# EAGLE design C1G14 VCO V5 (EAGLE 9.6.2)
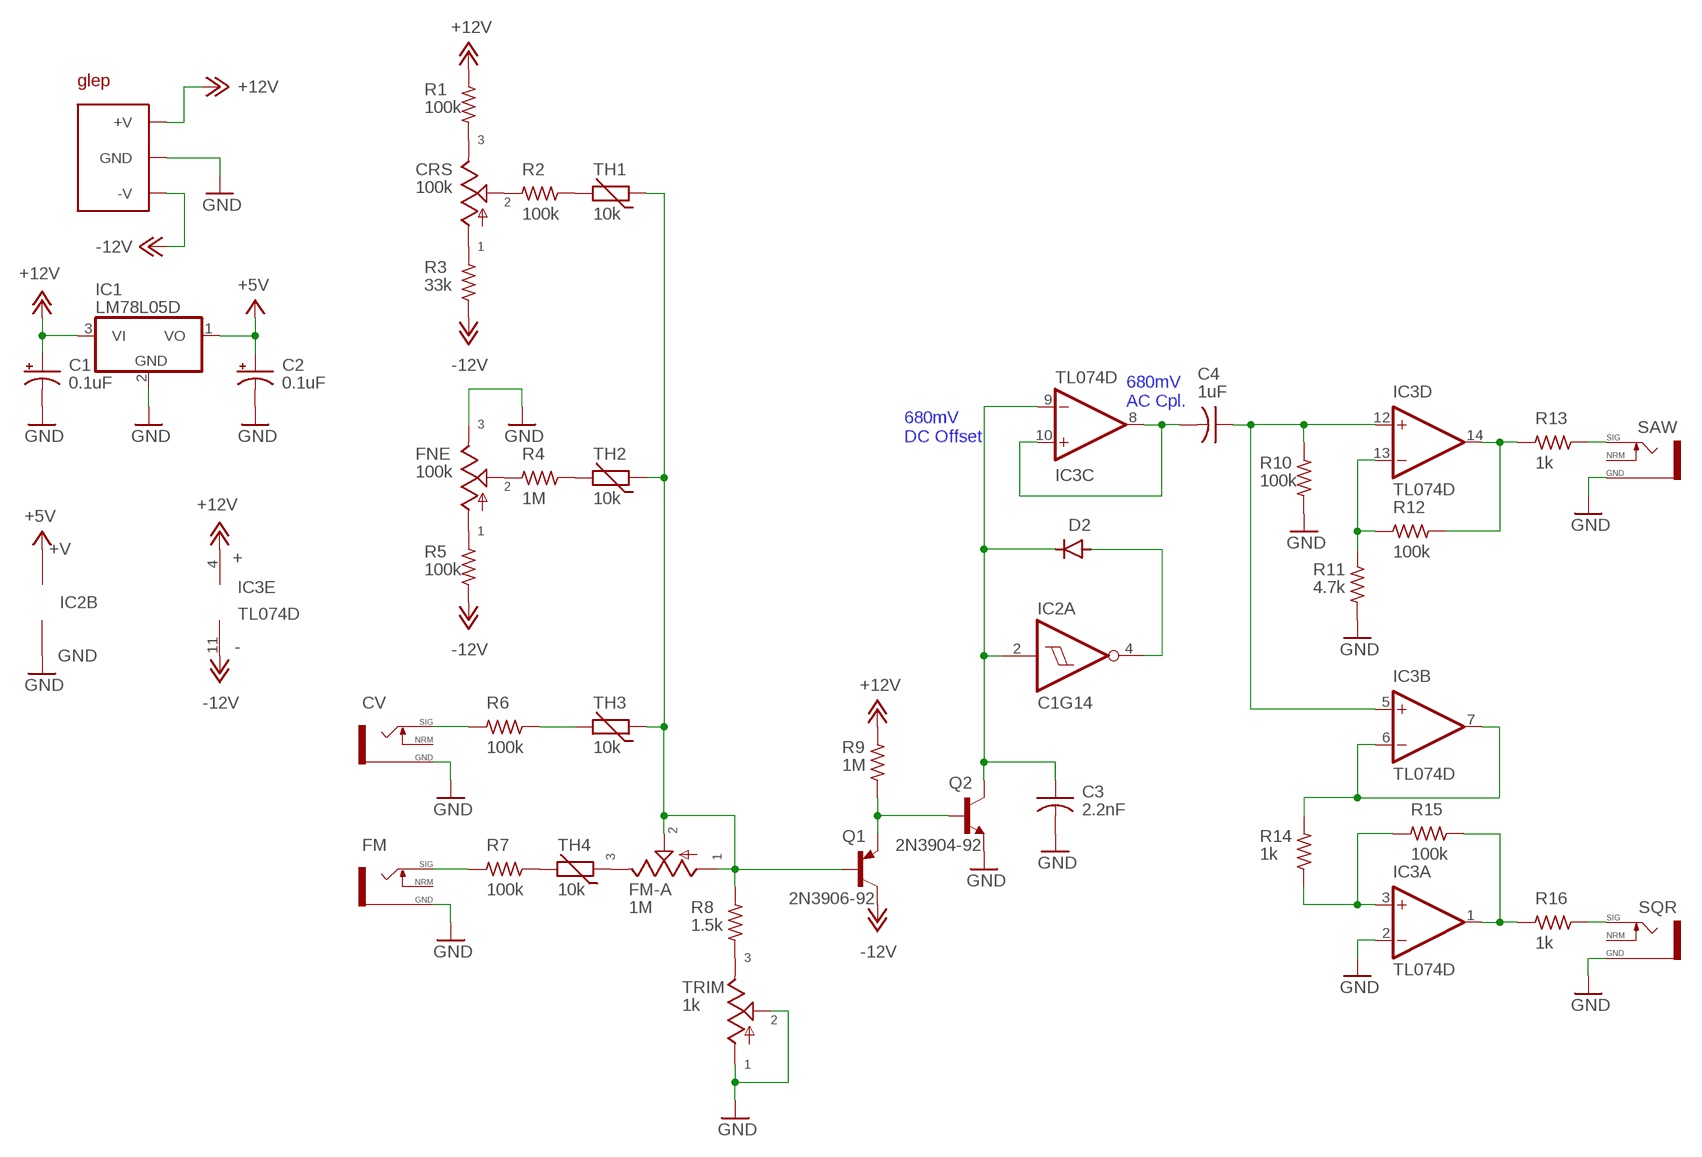
[diagram p0: schematic, sheet 1]

## Parts
C1  0.1uF  CPOL-E025  [E025]
C2  0.1uF  CPOL-E025  [E025]
C3  2.2nF  C-05  [C05]
C4  1uF  C-05  [C05]
CRS  100k  PHDR  [HEADER]
CV  MONOHDR  [HEADER]
D2  D-123  [SOD-123]
FM  MONOHDR  [HEADER]
FM-A  1M  PHDR  [HEADER]
FNE  100k  PHDR  [HEADER]
IC1  LM78L05D  [LM78LXX]
IC2  C1G14  [SOT-23-5]
IC3  TL074D  [DIL14]
Q1  2N3906-92  [TO92]
Q2  2N3904-92  [TO92]
R1  100k  R-1206  [R1206]
R2  100k  R-1206  [R1206]
R3  33k  R-1206  [R1206]
R4  1M  R-1206  [R1206]
R5  100k  R-1206  [R1206]
R6  100k  R-1206  [R1206]
R7  100k  R-1206  [R1206]
R8  1.5k  R-1206  [R1206]
R9  1M  R-1206  [R1206]
R10  100k  R-1206  [R1206]
R11  4.7k  R-1206  [R1206]
R12  100k  R-1206  [R1206]
R13  1k  R-1206  [R1206]
R14  1k  R-1206  [R1206]
R15  100k  R-1206  [R1206]
R16  1k  R-1206  [R1206]
SAW  MONOHDR  [HEADER]
SQR  MONOHDR  [HEADER]
TH1  10k  TH-025  [TH025]
TH2  10k  TH-025  [TH025]
TH3  10k  TH-025  [TH025]
TH4  10k  TH-025  [TH025]
TRIM  1k  PHDR  [HEADER]
U$1  10PIN-PWR  [10PIN-HEADER]
U$2  GLEP  [GLEP]

## Nets
+5V: C2.+ IC1.1(VO) IC2.5(B:V+)
+12V: C1.+ IC1.3(VI) IC3.4(E:V+) R1.2 R9.2 U$1.9(+V) U$1.10(+V)
-12V: IC3.11(E:V-) Q1.3(C) R3.1 R5.1 U$1.1(-V) U$1.2(-V)
GND: C1.- C2.- C3.2 CV.GND(SLEEVE-GND) FM.GND(SLEEVE-GND) FNE.3 IC1.2(GND) IC2.3(B:GND) IC3.2(A:INVERTING(-)) Q2.1(E) R10.1 R11.1 SAW.GND(SLEEVE-GND) SQR.GND(SLEEVE-GND) TRIM.1 TRIM.2 U$1.3(GND) U$1.4(GND) U$1.5(GND) U$1.6(GND) U$1.7(GND) U$1.8(GND)
N$1: CRS.2 R2.1
N$2: C4.2 IC3.8(C:OUT) IC3.10(C:NON-INVERTING(+))
N$3: CRS.1 R3.2
N$4: R2.2 TH1.2
N$5: CRS.3 R1.1
N$6: FNE.2 R4.1
N$7: R4.2 TH2.2
N$8: FNE.1 R5.2
N$9: IC3.6(B:INVERTING(-)) IC3.7(B:OUT) R14.2
N$10: R6.2 TH3.2
N$11: FM.TIP-SIG R7.1
N$12: R7.2 TH4.2
N$13: FM-A.3 TH4.1
N$14: R8.1 TRIM.3
N$15: CV.TIP-SIG R6.1
N$16: Q1.1(E) Q2.2(B) R9.1
N$17: C4.1 IC3.5(B:NON-INVERTING(+)) IC3.12(D:NON-INVERTING(+)) R10.2
N$18: C3.1 D2.C IC2.2(A:A) IC3.9(C:INVERTING(-)) Q2.3(C)
N$19: D2.A IC2.4(A:Y)
N$20: IC3.13(D:INVERTING(-)) R11.2 R12.1
N$21: IC3.14(D:OUT) R12.2 R13.1
N$22: R13.2 SAW.TIP-SIG
N$23: FM-A.1 FM-A.2 Q1.2(B) R8.2 TH1.1 TH2.1 TH3.1
N$24: IC3.3(A:NON-INVERTING(+)) R14.1 R15.1
N$25: IC3.1(A:OUT) R15.2 R16.1
N$26: R16.2 SQR.TIP-SIG
Unconnected: CV.NORM(SWITCH-NORM) FM.NORM(SWITCH-NORM) SAW.NORM(SWITCH-NORM) SQR.NORM(SWITCH-NORM)

## Notes on the sheet
- 680mV
  AC Cpl.
- 680mV
  DC Offset

## Library data of the parts
C1 C2 = wb-rcl:CPOL
C3 C4 = wb-rcl:C
CRS FM-A FNE TRIM = wb-potswitch:P
CV FM SAW SQR = wb-jacks:MONO
D2 = wb-diode:D
IC1 = wb-power:LM78L05
IC2 = wb-logic:C1G14
IC3 = wb-opamps:TL074: Low-Noise FET-Input Operational Amplifier https://www.ti.com/lit/ds/symlink/tl074.pdf
Q1 = wb-transistors:2N3906: https://www.mouser.com/datasheet/2/149/2n3906-285843.pdf
Q2 = wb-transistors:2N3904: https://www.mouser.com/datasheet/2/149/2N3904-82270.pdf
R1-R16 = wb-rcl:R
TH1-TH4 = wb-rcl:TH
U$1 = wb-power:10PIN-PWR
U$2 = wb-art:GLEP

## Board
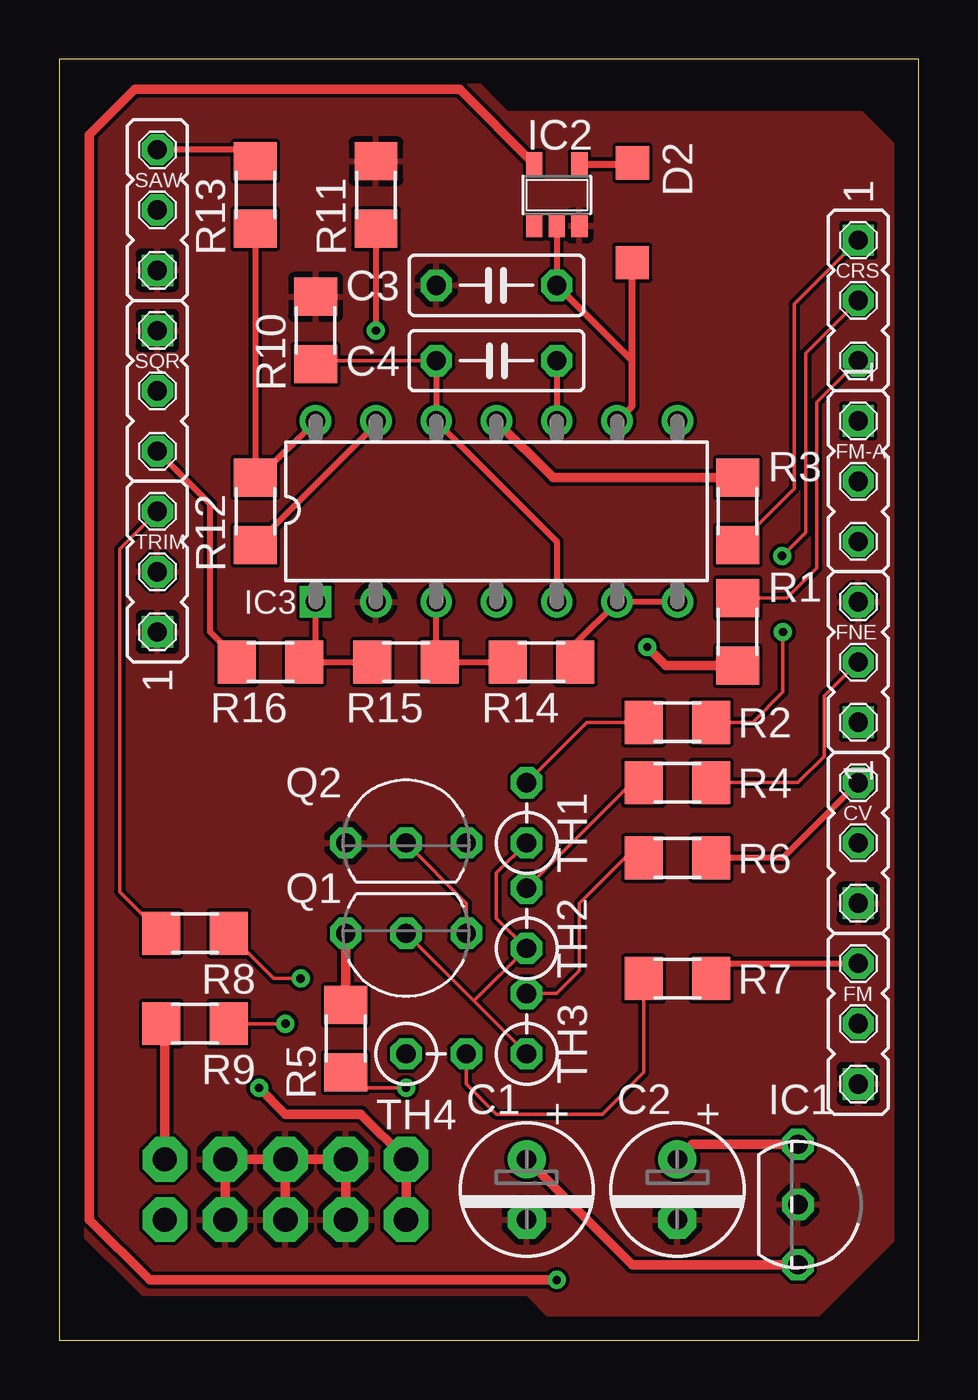
[diagram p1: board, top side]
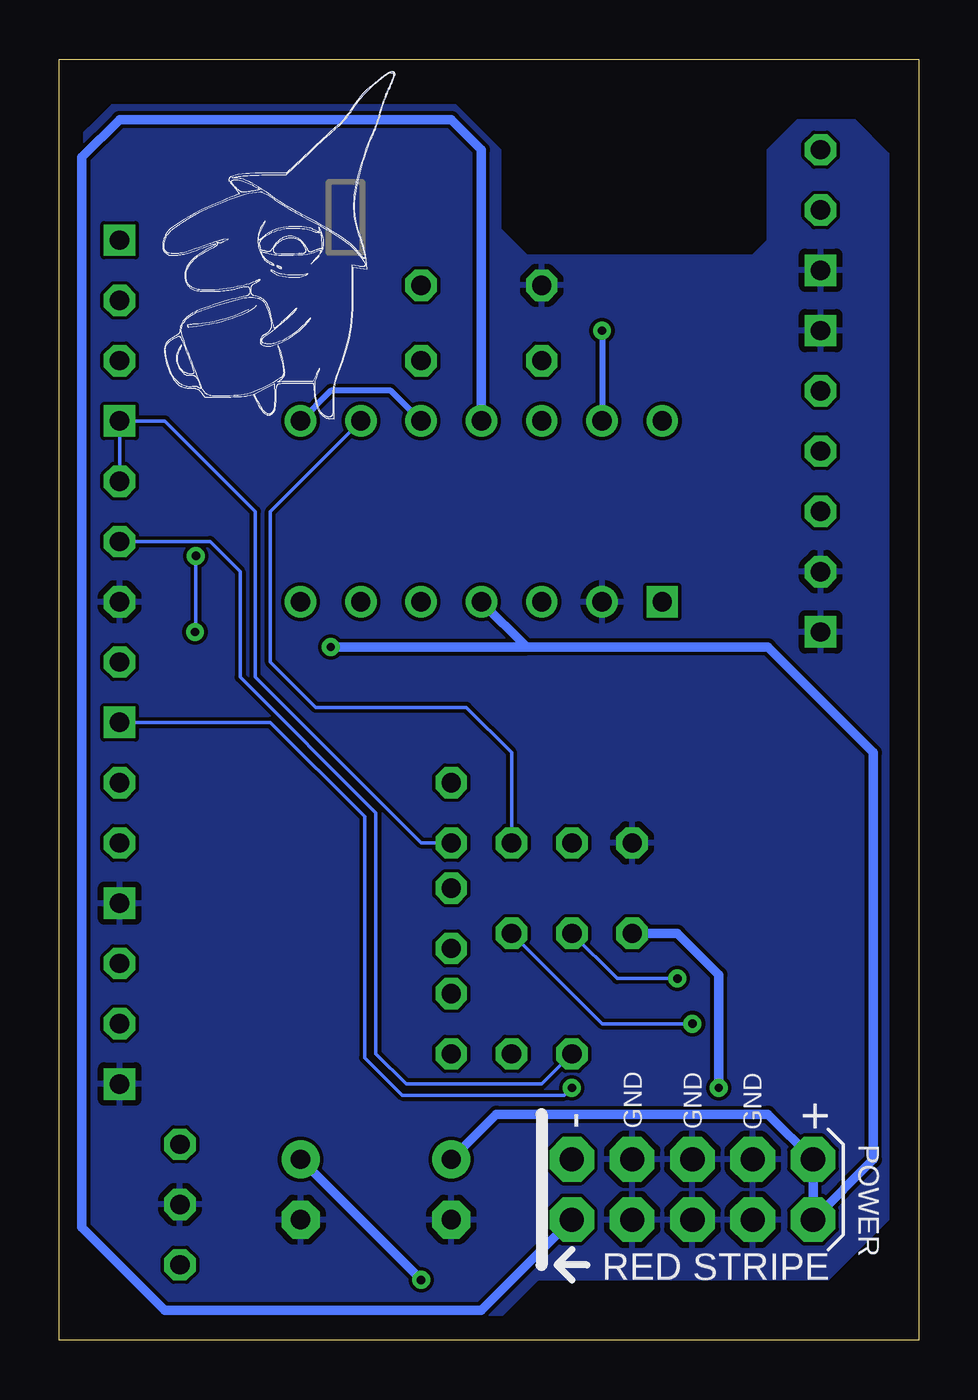
[diagram p2: board, bottom side, seen from below]

Size 36.2 x 53.98 mm. Coordinates in mm from the lower left corner, seen from the top.
Outline: 0,0 36.2,0 36.2,53.98 0,53.98 0,0
Copper layers (1*16): Top 0.035mm / dielectric 1.5mm / Bottom 0.035mm
Design rules "default": minimum track width 6mil, minimum drill 0.35mm, track to track 6mil, track to pad 6mil, pad to pad 6mil, via to via 6mil, smd to smd 6mil, copper to edge 40mil, drill to drill 6mil, minimum pad ring 10mil, minimum via ring 8mil, stop-mask expansion 4mil, vias tented up to drill 0mil, thermal gap 10mil

### Footprints (pad centres in the part's own frame; a part is rotated, then mirrored left to right if it is on the bottom)
E025 = drill 0.813 pad 1.6: + -1.27,0 | drill 0.813 pad 1.6 octagon: - 1.27,0
C05 = drill 0.813 octagon: 1 -2.54,0; 2 2.54,0
HEADER = drill 0.813 square: 1 -2.54,0 | drill 0.813 octagon: 2 0,0; 3 2.54,0
HEADER' = drill 0.813 square: GND -2.54,0 | drill 0.813 octagon: NORM 0,0; TIP-SIG 2.54,0
SOD-123 = smd 1.4 x 1.4: A -1.984,0.013; C 2.223,0
LM78LXX = drill 0.813 octagon: 1 -2.54,0; 2 0,0; 3 2.54,0
SOT-23-5 = smd 0.69 x 0.99: 1 -0.95,-1.29; 2 0,-1.29; 3 0.95,-1.29; 4 0.95,1.3; 5 -0.95,1.3
DIL14 = drill 0.813 square: 1 -7.62,-3.81 | drill 0.813: 2 -5.08,-3.81; 3 -2.54,-3.81; 4 0,-3.81; 5 2.54,-3.81; 6 5.08,-3.81; 7 7.62,-3.81; 8 7.62,3.81; 9 5.08,3.81; 10 2.54,3.81; 11 0,3.81; 12 -2.54,3.81; 13 -5.08,3.81; 14 -7.62,3.81
TO92 = drill 0.813 octagon: 1 -2.54,0; 2 0,0; 3 2.54,0
R1206 = smd 1.6 x 1.803: 1 -1.422,0; 2 1.422,0
TH025 = drill 0.813 octagon: 1 -1.27,0; 2 1.27,0
10PIN-HEADER = drill 1.016 pad 1.88 octagon: 1 -5.08,-1.27; 2 -5.08,1.27; 3 -2.54,-1.27; 4 -2.54,1.27; 5 0,-1.27; 6 0,1.27; 7 2.54,-1.27; 8 2.54,1.27; 9 5.08,-1.27; 10 5.08,1.27

### Placement (x,y rotation side)
C1  19.68,6.35 270 top
C2  26.04,6.35 270 top
C3  18.41,44.45 180 top
C4  18.41,41.27 0 top
CRS  33.66,43.81 270 top
CV  [HEADER']  33.66,20.95 90 top
D2  24.13,47.62 270 top
FM  [HEADER']  33.66,13.34 90 top
FM-A  33.66,36.2 270 top
FNE  33.66,28.57 90 top
IC1  31.11,5.71 270 top
IC2  20.95,48.26 0 top
IC3  18.41,34.92 0 top
Q1  14.61,17.14 180 top
Q2  14.61,20.95 0 top
R1  28.57,29.84 270 top
R2  26.04,26.04 180 top
R3  28.57,34.92 270 top
R4  26.04,23.5 180 top
R5  12.06,12.7 270 top
R6  26.04,20.32 180 top
R7  26.04,15.24 180 top
R8  5.71,17.14 0 top
R9  5.71,13.34 180 top
R10  10.79,42.55 270 top
R11  13.34,48.26 270 top
R12  8.26,34.92 90 top
R13  8.26,48.26 90 top
R14  20.32,28.57 0 top
R15  14.61,28.57 180 top
R16  8.89,28.57 180 top
SAW  [HEADER']  4.13,47.62 90 top
SQR  [HEADER']  4.13,40.01 270 top
TH1  19.68,22.23 90 top
TH2  19.68,17.78 90 top
TH3  19.68,13.34 90 top
TH4  15.88,12.06 0 top
TRIM  4.13,32.38 90 top
U$1  9.53,6.35 0 bottom
U$2  26.35,43.81 0 bottom

### Tracks (layer width: path | path; a pad name or v marks a point on that pad's centre or on a via)
+5V  (via drill 0.35)
  Top 0.406: IC1.1 26.67,8.26 C2.+ | IC2.5 16.86,52.7 3.17,52.7 1.27,50.8 1.27,5.08 3.81,2.54 v20.95,2.54
  Bottom 0.406: C2.+ v20.95,2.54
+12V  (via drill 0.35)
  Top 0.406: R9.2 4.45,13.18 U$1.10 | C1.+ 24.13,3.17 IC1.3 | 28.57,27.94 R1.2 25.55,28.42 v24.77,29.21
  Bottom 0.406: 16.51,29.21 6.35,29.21 1.91,24.77 1.91,7.62 U$1.9 U$1.10 6.35,9.53 17.78,9.53 C1.+ | 16.51,29.21 IC3.4 | v24.77,29.21 16.51,29.21
-12V  (via drill 0.35)
  Top 0.406: R5.1 Q1.3 | R3.1 20.8,36.35 IC3.11 | U$1.1 U$1.2 12.7,9.53 9.53,9.53 v8.41,10.64
  Bottom 0.406: IC3.11 18.41,50.16 19.68,51.44 33.66,51.44 35.24,49.85 35.24,4.76 31.75,1.27 18.41,1.27 U$1.1 | v8.41,10.64 8.41,15.4 10.16,17.14 Q1.3
GND
  Top 0.406: U$1.6 U$1.8 U$1.7 | U$1.6 U$1.4 U$1.3 | U$1.5 U$1.6
  pour Bottom: 2.7,51.44 1.27,50.01 1.27,5.08 3.81,2.54 16.03,2.54 18.1,0.48 32.07,0.48 35.88,4.29 35.88,50.16 33.97,52.07 19.53,52.07 17.62,50.16 17.62,46.83 16.51,45.72 6.99,45.72 6.35,46.35 6.35,50.16 5.08,51.44
  pour Top: 0.64,51.12 0.64,4.76 3.49,1.91 19.68,1.91 20.64,0.95 31.91,0.95 35.56,4.6 35.56,50.01 33.81,51.75 18.89,51.75 17.3,53.34 2.86,53.34
N$1  (via drill 0.35)
  Top 0.152: CRS.2 31.43,41.59 31.43,34.04 v30.44,33.05 | v30.48,29.84 30.48,27.3 29.21,26.04 R2.1
  Bottom 0.152: v30.44,33.05 30.44,29.88 v30.48,29.84
N$2
  Top 0.254: C4.2 IC3.10
  Bottom 0.254: IC3.10 22.23,40.01 24.77,40.01 IC3.8
N$3
  Top 0.152: CRS.1 30.96,43.66 30.96,35.88 R3.2
N$4
  Top 0.152: TH1.2 22.23,26.04 R2.2
N$5
  Top 0.152: 28.73,31.11 R1.1 30.63,31.27 31.91,32.54 31.91,39.53 CRS.3
N$6
  Top 0.152: R4.1 31.11,23.5 32.23,24.61 32.23,27.15 FNE.2
N$7
  Top 0.152: TH2.2 24.13,23.5 R4.2
N$8  (via drill 0.35)
  Top 0.152: v14.61,10.64 12.71,10.64 R5.2
  Bottom 0.152: FNE.1 27.3,26.04 23.34,22.07 23.34,11.91 21.75,10.32 14.92,10.32 v14.61,10.64
N$9
  Top 0.254: R14.2 21.74,29.36 IC3.6 IC3.7
N$10
  Top 0.152: R6.2 24.3,20.64 24.13,20.64 21.91,18.41 21.91,15.56 20.95,14.61 TH3.2
N$11
  Top 0.254: R7.1 27.94,15.72 27.94,15.88 FM.TIP-SIG
N$12
  Top 0.152: TH4.2 17.14,10.79 18.41,9.53 22.86,9.53 24.61,11.28 R7.2
N$13
  Bottom 0.152: TH4.1 15.88,10.79 21.59,10.79 22.86,12.06 22.86,22.23 28.57,27.94 28.57,32.38 29.84,33.66 FM-A.3
N$14
  Top 0.152: TRIM.3 2.54,33.34 2.54,18.9 R8.1
N$15
  Top 0.254: CV.TIP-SIG 30.48,20.32 R6.1
N$16  (via drill 0.35)
  Top 0.152: Q2.2 17.14,18.41 Q1.1 | v9.53,13.34 R9.1
  Bottom 0.152: Q1.1 13.34,13.34 v9.53,13.34
N$17
  Top 0.152: R10.2 10.95,41.27 C4.1
  Top 0.254: C4.1 IC3.12 20.95,33.66 IC3.5
N$18
  Top 0.254: IC2.2 C3.1
  Top 0.305: IC3.9 24.13,39.37 24.13,41.27 | 24.13,41.27 D2.C | C3.1 24.13,41.27
  Bottom 0.152: IC3.9 27.3,34.92 27.3,28.57 25.4,26.67 19.05,26.67 17.14,24.77 Q2.3
N$19
  Top 0.254: IC2.4 21.91,49.84
  Top 0.305: IC2.4 24.09,49.56 D2.A
N$20  (via drill 0.35)
  Top 0.254: R11.2 v13.34,42.55 | IC3.13 13.34,38.58 R12.1
  Bottom 0.254: v13.34,42.55 IC3.13
N$21
  Top 0.254: IC3.14 8.41,36.35 R12.2 R13.1
N$22
  Top 0.254: R13.2 7.77,50.16 SAW.TIP-SIG
N$23  (via drill 0.35)
  Top 0.152: TH1.1 18.41,19.68 18.41,17.78 TH2.1 17.46,14.29 | Q1.2 17.46,14.29 | 17.46,14.29 TH3.1 | R8.2 9.04,15.24 v10.16,15.24
  Bottom 0.152: v10.16,15.24 12.7,15.24 Q1.2 | TH1.1 20.95,20.95 27.94,27.94 27.94,34.92 31.75,38.73 FM-A.1 FM-A.2
N$24
  Top 0.254: R14.1 R15.1 15.88,28.73 IC3.3
N$25
  Top 0.254: R15.2 R16.1 10.79,29.06 IC3.1
N$26
  Top 0.254: R16.2 7.47,28.73 6.35,29.84 6.35,35.24 SQR.TIP-SIG